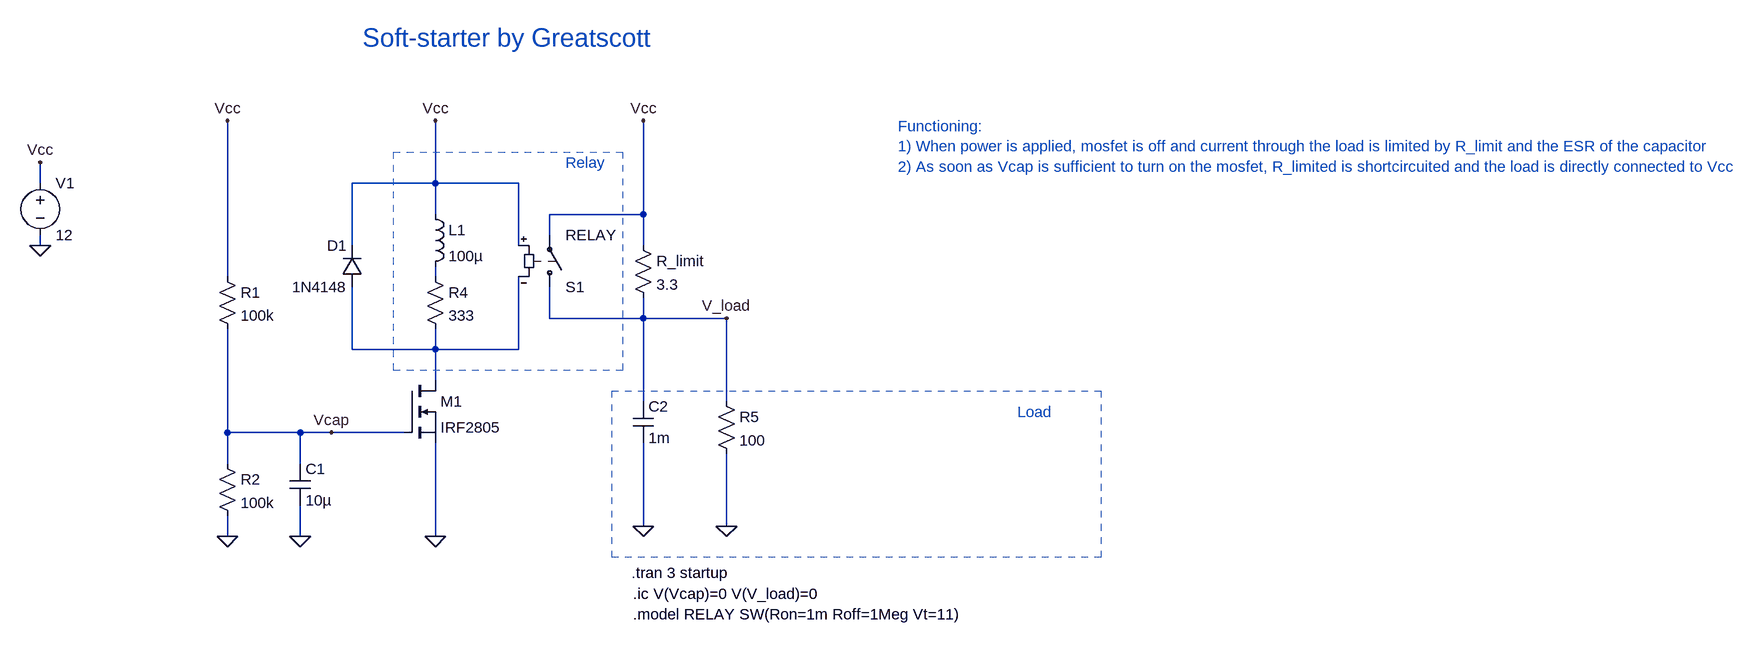
[diagram p0: schematic soft-starter-12V.asc]
soft-starter-12V.asc, the LTspice schematic file:
Version 4
SHEET 1 2440 680
WIRE -256 -208 -256 -240
WIRE 352 -208 352 -304
WIRE 352 -208 224 -208
WIRE 480 -208 352 -208
WIRE 352 -160 352 -208
WIRE 672 -160 672 -304
WIRE 672 -160 528 -160
WIRE 528 -128 528 -160
WIRE -256 -112 -256 -128
WIRE 224 -112 224 -208
WIRE 480 -112 480 -208
WIRE 672 -112 672 -160
WIRE 32 -64 32 -304
WIRE 352 -64 352 -80
WIRE 528 0 528 -48
WIRE 672 0 672 -32
WIRE 672 0 528 0
WIRE 800 0 672 0
WIRE 224 48 224 -48
WIRE 352 48 352 16
WIRE 352 48 224 48
WIRE 480 48 480 -64
WIRE 480 48 352 48
WIRE 352 96 352 48
WIRE 672 128 672 0
WIRE 800 128 800 0
WIRE 32 176 32 16
WIRE 144 176 32 176
WIRE 192 176 144 176
WIRE 304 176 192 176
WIRE 32 224 32 176
WIRE 144 224 144 176
WIRE 672 320 672 192
WIRE 800 320 800 208
WIRE 32 336 32 304
WIRE 144 336 144 288
WIRE 352 336 352 192
FLAG -256 -112 0
FLAG 32 336 0
FLAG 144 336 0
FLAG 352 336 0
FLAG 672 320 0
FLAG -256 -240 Vcc
FLAG 352 -304 Vcc
FLAG 32 -304 Vcc
FLAG 672 -304 Vcc
FLAG 800 320 0
FLAG 192 176 Vcap
FLAG 800 0 V_load
SYMBOL res 16 -80 R0
SYMATTR InstName R1
SYMATTR Value 100k
SYMBOL res 16 208 R0
SYMATTR InstName R2
SYMATTR Value 100k
SYMBOL cap 128 224 R0
SYMATTR InstName C1
SYMATTR Value 10µ
SYMBOL nmos 304 96 R0
SYMATTR InstName M1
SYMATTR Value IRF2805
SYMBOL ind 336 -176 R0
SYMATTR InstName L1
SYMATTR Value 100µ
SYMBOL diode 240 -48 R180
WINDOW 0 24 64 Left 2
WINDOW 3 24 0 Left 2
SYMATTR InstName D1
SYMATTR Value 1N4148
SYMBOL res 656 -128 R0
SYMATTR InstName R_limit
SYMATTR Value 3.3
SYMBOL voltage -256 -224 R0
WINDOW 123 0 0 Left 0
WINDOW 39 0 0 Left 0
SYMATTR InstName V1
SYMATTR Value 12
SYMBOL sw 528 -32 M180
SYMATTR InstName S1
SYMATTR Value RELAY
SYMBOL res 336 -80 R0
SYMATTR InstName R4
SYMATTR Value 333
SYMBOL cap 656 128 R0
SYMATTR InstName C2
SYMATTR Value 1m
SYMBOL res 784 112 R0
SYMATTR InstName R5
SYMATTR Value 100
TEXT 654 392 Left 2 !.tran 3 startup
TEXT 656 456 Left 2 !.model RELAY SW(Ron=1m Roff=1Meg Vt=11)
TEXT 656 424 Left 2 !.ic V(Vcap)=0 V(V_load)=0
TEXT 552 -240 Left 2 ;Relay
TEXT 240 -432 Left 4 ;Soft-starter by Greatscott
TEXT 1248 144 Left 2 ;Load
TEXT 1064 -296 Left 2 ;Functioning:\n1) When power is applied, mosfet is off and current through the load is limited by R_limit and the ESR of the capacitor\n2) As soon as Vcap is sufficient to turn on the mosfet, R_limited is shortcircuited and the load is directly connected to Vcc
RECTANGLE Normal 640 80 288 -256 2
RECTANGLE Normal 1376 368 624 112 2

The netlist it stands for:
* soft-starter-12V.asc
R1 Vcc Vcap 100k
R2 Vcap 0 100k
C1 Vcap 0 10µ
M1 N002 Vcap 0 0 IRF2805
L1 Vcc N001 100µ
D1 N002 Vcc 1N4148
R_limit Vcc V_load 3.3
V1 Vcc 0 12
S1 V_load Vcc Vcc N002 RELAY
R4 N001 N002 333
C2 V_load 0 1m
R5 V_load 0 100
.model D D
.lib standard.dio
.model NMOS NMOS
.model PMOS PMOS
.lib standard.mos
.tran 3 startup
.model RELAY SW(Ron=1m Roff=1Meg Vt=11)
.ic V(Vcap)=0 V(V_load)=0
* Relay
* Soft-starter by Greatscott
* Load
* Functioning:
* 1) When power is applied, mosfet is off and current through the load is limited by R_limit and the ESR of the capacitor
* 2) As soon as Vcap is sufficient to turn on the mosfet, R_limited is shortcircuited and the load is directly connected to Vcc
.backanno
.end